# Altium schematic sheet bbb_db25_cnc_cape.SchDoc
size A4
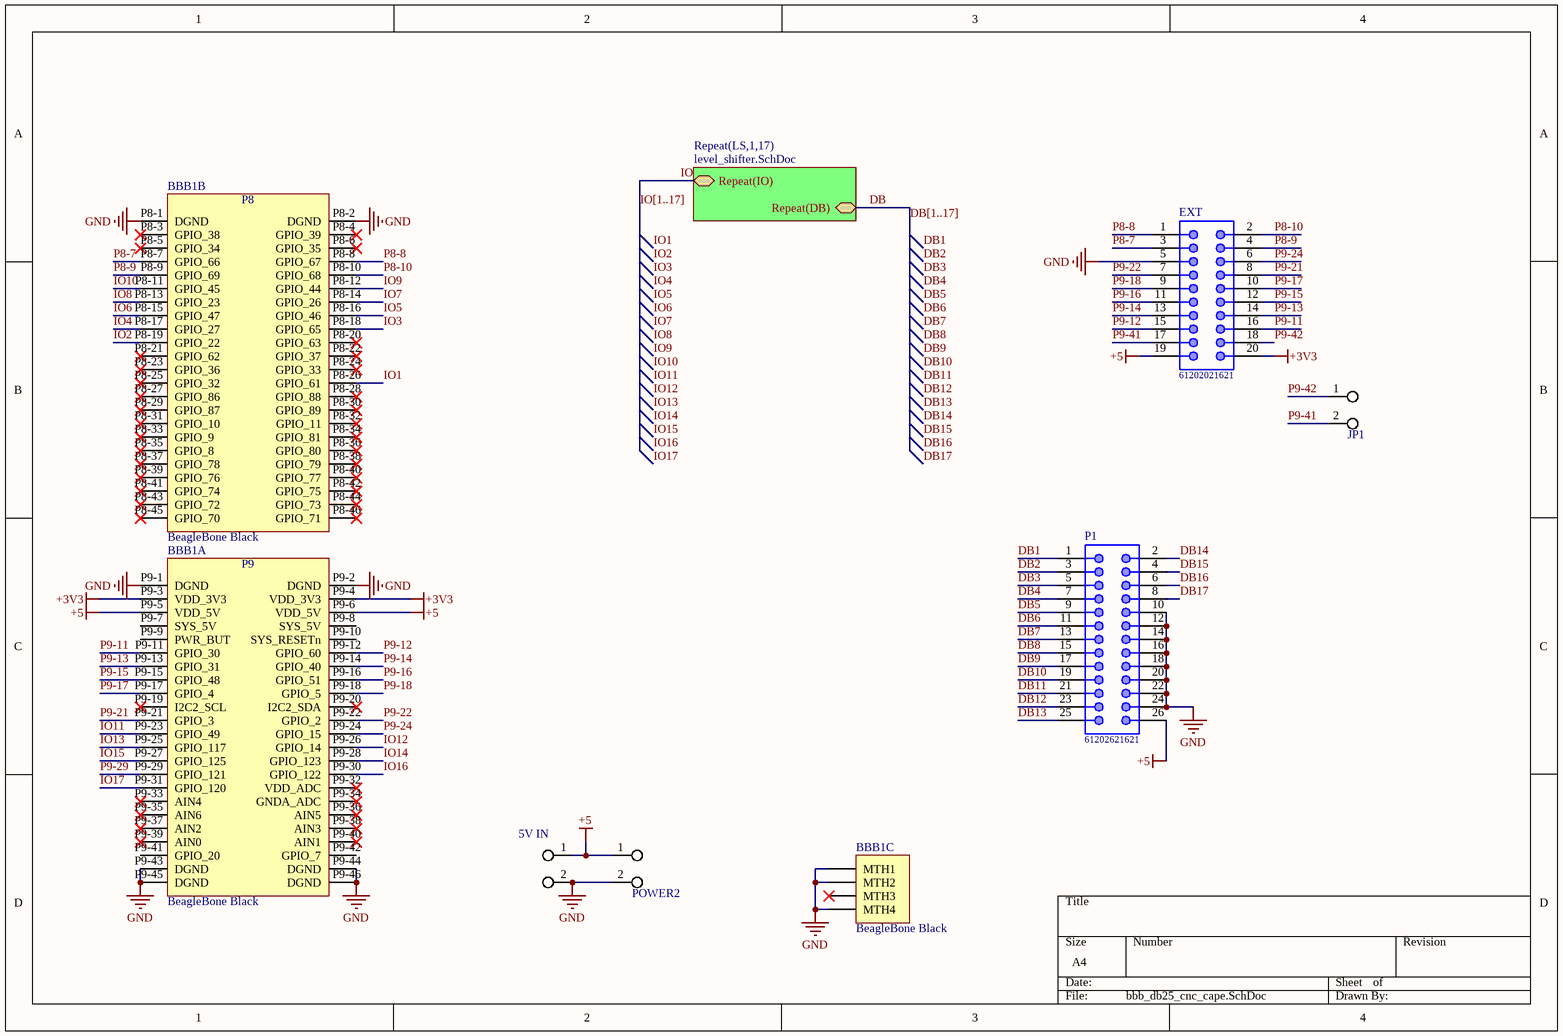
[diagram p0: bbb_db25_cnc_cape.SchDoc]

## Parts
5V_IN  Header 1x2  [Screw Terminal 1x2 5.08mm Vertical]  (value not drawn)
BBB1  BeagleBone Black  [BeagleBone_Black_Cape]  (parts A,B,C of 3)
EXT  61202021621  [61202021621]
JP1  Header 1x2  [Header 1x2 100mil Vertical]  (value not drawn)
P1  61202621621  [61202621621]
POWER2  Header 1x2  [Screw Terminal 1x2 3.5mm Vertical]  (value not drawn)

## Sub-sheets
Repeat(LS,1,17) = level_shifter.SchDoc: Repeat(IO) (bidir), Repeat(DB) (bidir)

## Nets
+3V3: BBB1.P9-3(VDD_3V3) BBB1.P9-4(VDD_3V3) EXT.20
+5: 5V_IN.1 BBB1.P9-5(VDD_5V) BBB1.P9-6(VDD_5V) EXT.19 P1.26 POWER2.1
GND: 5V_IN.2 BBB1.MTH1 BBB1.MTH2 BBB1.MTH4 BBB1.P8-1(DGND) BBB1.P8-2(DGND) BBB1.P9-1(DGND) BBB1.P9-2(DGND) BBB1.P9-43(DGND) BBB1.P9-44(DGND) BBB1.P9-45(DGND) BBB1.P9-46(DGND) EXT.5 P1.10 P1.12 P1.14 P1.16 P1.18 P1.20 P1.22 P1.24 POWER2.2
DB: sheet Repeat(LS,1,17)/Repeat(DB)
DB1: P1.1
DB2: P1.3
DB3: P1.5
DB4: P1.7
DB5: P1.9
DB6: P1.11
DB7: P1.13
DB8: P1.15
DB9: P1.17
DB10: P1.19
DB11: P1.21
DB12: P1.23
DB13: P1.25
DB14: P1.2
DB15: P1.4
DB16: P1.6
DB17: P1.8
IO: sheet Repeat(LS,1,17)/Repeat(IO)
IO1: BBB1.P8-26(GPIO_61)
IO2: BBB1.P8-19(GPIO_22)
IO3: BBB1.P8-18(GPIO_65)
IO4: BBB1.P8-17(GPIO_27)
IO5: BBB1.P8-16(GPIO_46)
IO6: BBB1.P8-15(GPIO_47)
IO7: BBB1.P8-14(GPIO_26)
IO8: BBB1.P8-13(GPIO_23)
IO9: BBB1.P8-12(GPIO_44)
IO10: BBB1.P8-11(GPIO_45)
IO11: BBB1.P9-23(GPIO_49)
IO12: BBB1.P9-26(GPIO_14)
IO13: BBB1.P9-25(GPIO_117)
IO14: BBB1.P9-28(GPIO_123)
IO15: BBB1.P9-27(GPIO_125)
IO16: BBB1.P9-30(GPIO_122)
IO17: BBB1.P9-31(GPIO_120)
P8-7: BBB1.P8-7(GPIO_66) EXT.3
P8-8: BBB1.P8-8(GPIO_67) EXT.1
P8-9: BBB1.P8-9(GPIO_69) EXT.4
P8-10: BBB1.P8-10(GPIO_68) EXT.2
P9-11: BBB1.P9-11(GPIO_30) EXT.16
P9-12: BBB1.P9-12(GPIO_60) EXT.15
P9-13: BBB1.P9-13(GPIO_31) EXT.14
P9-14: BBB1.P9-14(GPIO_40) EXT.13
P9-15: BBB1.P9-15(GPIO_48) EXT.12
P9-16: BBB1.P9-16(GPIO_51) EXT.11
P9-17: BBB1.P9-17(GPIO_4) EXT.10
P9-18: BBB1.P9-18(GPIO_5) EXT.9
P9-21: BBB1.P9-21(GPIO_3) EXT.8
P9-22: BBB1.P9-22(GPIO_2) EXT.7
P9-24: BBB1.P9-24(GPIO_15) EXT.6
P9-29: BBB1.P9-29(GPIO_121)
P9-41: EXT.17 JP1.2
P9-42: EXT.18 JP1.1

Not connected (* = marked no-connect by the designer): BBB1 MTH3* P8-3(GPIO_38)* P8-4(GPIO_39)* P8-5(GPIO_34)* P8-6(GPIO_35)* P8-20(GPIO_63)* P8-21(GPIO_62)* P8-22(GPIO_37)* P8-23(GPIO_36)* P8-24(GPIO_33)* P8-25(GPIO_32)* P8-27(GPIO_86)* P8-28(GPIO_88)* P8-29(GPIO_87)* P8-30(GPIO_89)* P8-31(GPIO_10)* P8-32(GPIO_11)* P8-33(GPIO_9)* P8-34(GPIO_81)* P8-35(GPIO_8)* P8-36(GPIO_80)* P8-37(GPIO_78)* P8-38(GPIO_79)* P8-39(GPIO_76)* P8-40(GPIO_77)* P8-41(GPIO_74)* P8-42(GPIO_75)* P8-43(GPIO_72)* P8-44(GPIO_73)* P8-45(GPIO_70)* P8-46(GPIO_71)* P9-7(SYS_5V) P9-8(SYS_5V) P9-9(PWR_BUT) P9-10(SYS_RESETn) P9-19(I2C2_SCL)* P9-20(I2C2_SDA)* P9-32(VDD_ADC)* P9-33(AIN4)* P9-34(GNDA_ADC)* P9-35(AIN6)* P9-36(AIN5)* P9-37(AIN2)* P9-38(AIN3)* P9-39(AIN0)* P9-40(AIN1)* P9-41(GPIO_20) P9-42(GPIO_7)

## Buses and harness runs
bus DB[1..17]
bus IO[1..17]

## Notes on the sheet
- Labels drawn without touching a wire or pin: DB1, DB2, DB3, DB4, DB5, DB6, DB7, DB8, DB9, DB10, DB11, DB12, DB13, DB14, DB15, DB16, DB17, IO1, IO2, IO3, IO4, IO5, IO6, IO7, IO8, IO9, IO10, IO11, IO12, IO13, IO14, IO15, IO16, IO17
- (in symbol BeagleBone Black, part A) P9
- (in symbol BeagleBone Black, part B) P8

## Library data of the parts
5V_IN JP1 POWER2 = Header 1x2: Standard Header Connector
EXT = 61202021621: Male Box Header WR-BHD, THT, Vertical, pitch 2.54 mm, 20 pins; Pitch: 2.54 mm; Working Voltage: 250 VAC; Withstanding Voltage: 500 VAC; Contact Resistance: 20 mOhm; Pin Number: 20; ComponentLink1Description: Manufacturer; ComponentLink1URL: http://www.we-online.de; ComponentLink2Description: Datasheet; ComponentLink2URL: https://katalog.we-online.de/em/datasheet/6120xx21621.pdf; Part Number: 61202021621; Published Date: August 2018; Publisher: Wurth Elektronik; Operating Temperature: -40 to 125 degC; Packaging: Tray; Gender: Male; Mounting Technology: THT; Orientation: Vertical
P1 = 61202621621: Male Box Header WR-BHD, THT, Vertical, pitch 2.54 mm, 26 pins; Pitch: 2.54 mm; Working Voltage: 250 VAC; Withstanding Voltage: 500 VAC; Contact Resistance: 20 mOhm; Pin Number: 26; ComponentLink1Description: Manufacturer; ComponentLink1URL: http://www.we-online.de; ComponentLink2Description: Datasheet; ComponentLink2URL: https://katalog.we-online.de/em/datasheet/6120xx21621.pdf; Part Number: 61202621621; Published Date: August 2018; Publisher: Wurth Elektronik; Operating Temperature: -40 to 125 degC; Packaging: Tray; Gender: Male; Mounting Technology: THT; Orientation: Vertical